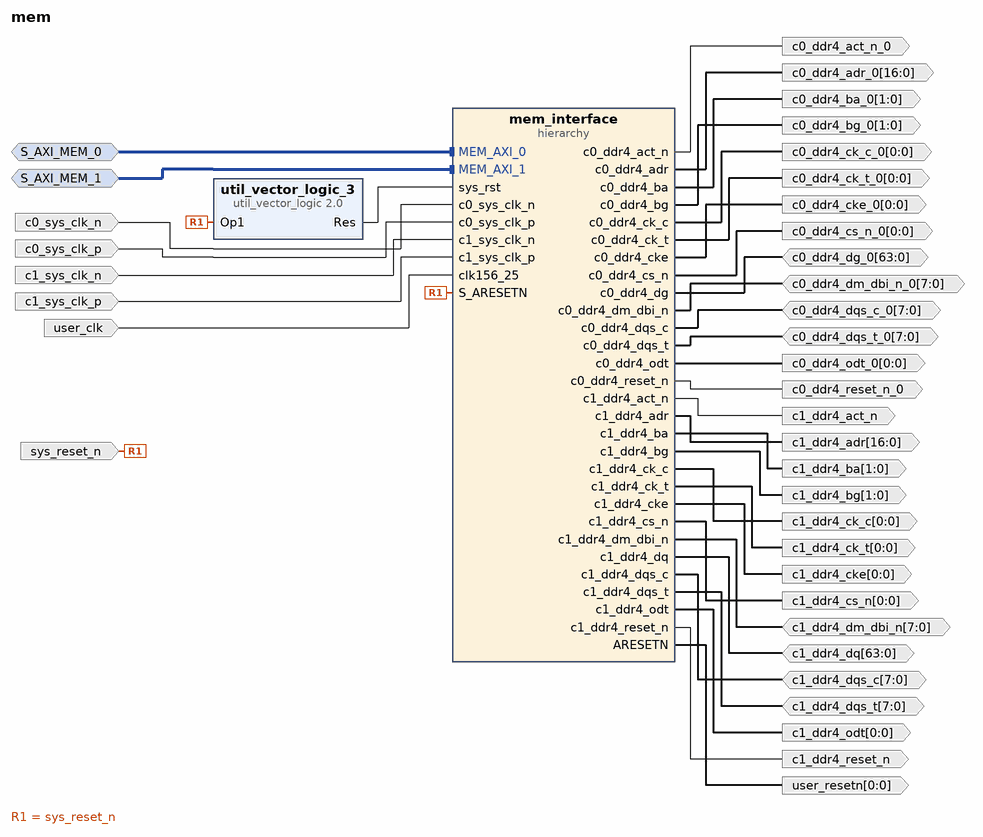
[diagram p0: block diagram of the top level]
# Vivado block design mem, xcku115-flva1517-2-e, Vivado 2018.2
create_bd_design mem

create_bd_intf_port -mode Slave -vlnv xilinx.com:interface:aximm_rtl:1.0 S_AXI_MEM_0
set_property -dict [list \
  CONFIG.DATA_WIDTH 512 \
  CONFIG.PROTOCOL AXI4 \
  CONFIG.ID_WIDTH 1 \
  CONFIG.ADDR_WIDTH 32 \
  CONFIG.AWUSER_WIDTH 0 \
  CONFIG.ARUSER_WIDTH 0 \
  CONFIG.WUSER_WIDTH 0 \
  CONFIG.RUSER_WIDTH 0 \
  CONFIG.BUSER_WIDTH 0 \
  CONFIG.READ_WRITE_MODE READ_WRITE \
  CONFIG.HAS_BURST 1 \
  CONFIG.HAS_LOCK 1 \
  CONFIG.HAS_PROT 1 \
  CONFIG.HAS_CACHE 1 \
  CONFIG.HAS_QOS 1 \
  CONFIG.HAS_REGION 1 \
  CONFIG.HAS_WSTRB 1 \
  CONFIG.HAS_BRESP 1 \
  CONFIG.HAS_RRESP 1 \
  CONFIG.SUPPORTS_NARROW_BURST 1 \
  CONFIG.NUM_READ_OUTSTANDING 2 \
  CONFIG.NUM_WRITE_OUTSTANDING 2 \
  CONFIG.MAX_BURST_LENGTH 256 \
  CONFIG.NUM_READ_THREADS 1 \
  CONFIG.NUM_WRITE_THREADS 1 \
  CONFIG.RUSER_BITS_PER_BYTE 0 \
  CONFIG.WUSER_BITS_PER_BYTE 0 \
] [get_bd_intf_ports S_AXI_MEM_0]
create_bd_intf_port -mode Slave -vlnv xilinx.com:interface:aximm_rtl:1.0 S_AXI_MEM_1
set_property -dict [list \
  CONFIG.DATA_WIDTH 512 \
  CONFIG.PROTOCOL AXI4 \
  CONFIG.ID_WIDTH 1 \
  CONFIG.ADDR_WIDTH 32 \
  CONFIG.AWUSER_WIDTH 0 \
  CONFIG.ARUSER_WIDTH 0 \
  CONFIG.WUSER_WIDTH 0 \
  CONFIG.RUSER_WIDTH 0 \
  CONFIG.BUSER_WIDTH 0 \
  CONFIG.READ_WRITE_MODE READ_WRITE \
  CONFIG.HAS_BURST 1 \
  CONFIG.HAS_LOCK 1 \
  CONFIG.HAS_PROT 1 \
  CONFIG.HAS_CACHE 1 \
  CONFIG.HAS_QOS 1 \
  CONFIG.HAS_REGION 1 \
  CONFIG.HAS_WSTRB 1 \
  CONFIG.HAS_BRESP 1 \
  CONFIG.HAS_RRESP 1 \
  CONFIG.SUPPORTS_NARROW_BURST 1 \
  CONFIG.NUM_READ_OUTSTANDING 2 \
  CONFIG.NUM_WRITE_OUTSTANDING 2 \
  CONFIG.MAX_BURST_LENGTH 256 \
  CONFIG.NUM_READ_THREADS 1 \
  CONFIG.NUM_WRITE_THREADS 1 \
  CONFIG.RUSER_BITS_PER_BYTE 0 \
  CONFIG.WUSER_BITS_PER_BYTE 0 \
] [get_bd_intf_ports S_AXI_MEM_1]
create_bd_port -dir O c0_ddr4_act_n_0
create_bd_port -dir O -from 16 -to 0 c0_ddr4_adr_0
create_bd_port -dir O -from 1 -to 0 c0_ddr4_ba_0
create_bd_port -dir O -from 1 -to 0 c0_ddr4_bg_0
create_bd_port -dir O -from 0 -to 0 -type clk c0_ddr4_ck_c_0
create_bd_port -dir O -from 0 -to 0 -type clk c0_ddr4_ck_t_0
create_bd_port -dir O -from 0 -to 0 c0_ddr4_cke_0
create_bd_port -dir O -from 0 -to 0 c0_ddr4_cs_n_0
create_bd_port -dir IO -from 63 -to 0 c0_ddr4_dg_0
create_bd_port -dir IO -from 7 -to 0 c0_ddr4_dm_dbi_n_0
create_bd_port -dir IO -from 7 -to 0 c0_ddr4_dqs_c_0
create_bd_port -dir IO -from 7 -to 0 c0_ddr4_dqs_t_0
create_bd_port -dir O -from 0 -to 0 c0_ddr4_odt_0
create_bd_port -dir O c0_ddr4_reset_n_0
create_bd_port -dir I -type clk c0_sys_clk_n
set_property -dict {CONFIG.FREQ_HZ 300000000} [get_bd_ports c0_sys_clk_n]
create_bd_port -dir I -type clk c0_sys_clk_p
set_property -dict {CONFIG.FREQ_HZ 300000000} [get_bd_ports c0_sys_clk_p]
create_bd_port -dir O c1_ddr4_act_n
create_bd_port -dir O -from 16 -to 0 c1_ddr4_adr
create_bd_port -dir O -from 1 -to 0 c1_ddr4_ba
create_bd_port -dir O -from 1 -to 0 c1_ddr4_bg
create_bd_port -dir O -from 0 -to 0 -type clk c1_ddr4_ck_c
create_bd_port -dir O -from 0 -to 0 -type clk c1_ddr4_ck_t
create_bd_port -dir O -from 0 -to 0 c1_ddr4_cke
create_bd_port -dir O -from 0 -to 0 c1_ddr4_cs_n
create_bd_port -dir IO -from 7 -to 0 c1_ddr4_dm_dbi_n
create_bd_port -dir IO -from 63 -to 0 c1_ddr4_dq
create_bd_port -dir IO -from 7 -to 0 c1_ddr4_dqs_c
create_bd_port -dir IO -from 7 -to 0 c1_ddr4_dqs_t
create_bd_port -dir O -from 0 -to 0 c1_ddr4_odt
create_bd_port -dir O c1_ddr4_reset_n
create_bd_port -dir I -type clk c1_sys_clk_n
set_property -dict {CONFIG.FREQ_HZ 300000000} [get_bd_ports c1_sys_clk_n]
create_bd_port -dir I -type clk c1_sys_clk_p
set_property -dict {CONFIG.FREQ_HZ 300000000} [get_bd_ports c1_sys_clk_p]
create_bd_port -dir I sys_reset_n
create_bd_port -dir I -type clk user_clk
create_bd_port -dir O -from 0 -to 0 user_resetn

create_bd_cell -type hier mem_interface
create_bd_cell -type ip -vlnv xilinx.com:ip:util_vector_logic:2.0 util_vector_logic_3
set_property -dict {CONFIG.C_SIZE 1 CONFIG.C_OPERATION not} [get_bd_cells util_vector_logic_3]

# ---- hierarchy /mem_interface ----
current_bd_instance /mem_interface
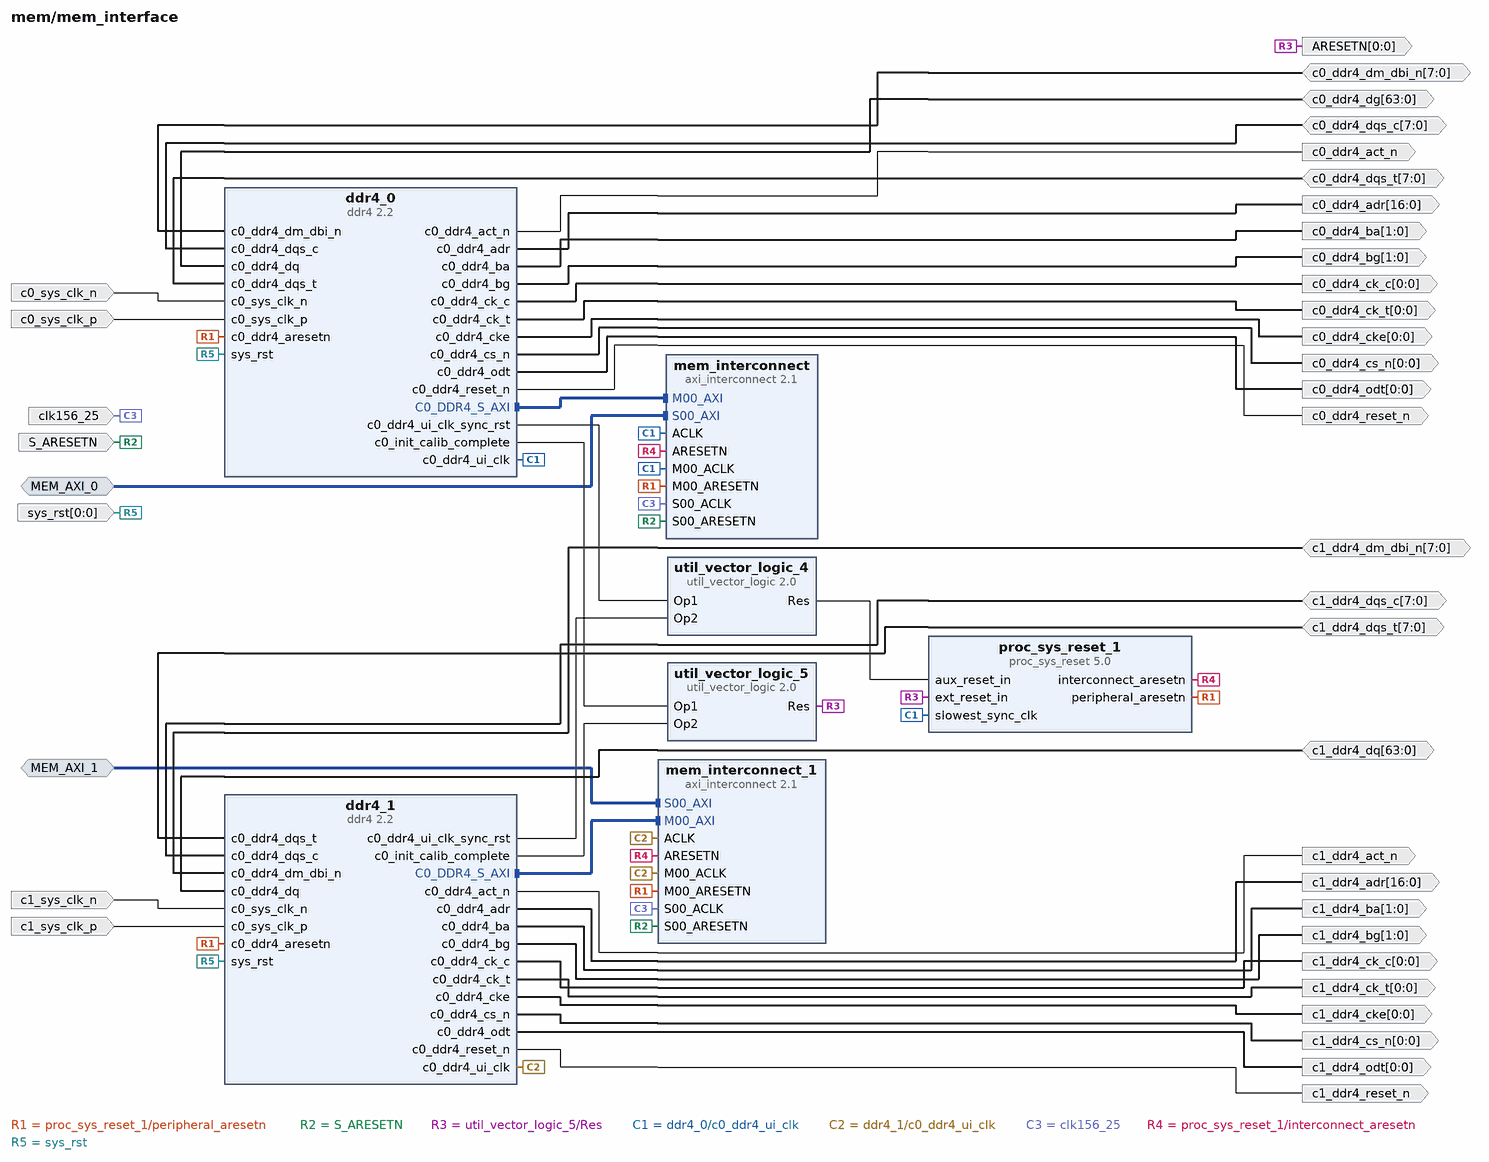
[diagram p1: block diagram inside /mem_interface]
create_bd_intf_pin -mode Slave -vlnv xilinx.com:interface:aximm_rtl:1.0 MEM_AXI_0
create_bd_intf_pin -mode Slave -vlnv xilinx.com:interface:aximm_rtl:1.0 MEM_AXI_1
create_bd_pin -dir O -from 0 -to 0 ARESETN
create_bd_pin -dir I -type rst S_ARESETN
create_bd_pin -dir O c0_ddr4_act_n
create_bd_pin -dir O -from 16 -to 0 c0_ddr4_adr
create_bd_pin -dir O -from 1 -to 0 c0_ddr4_ba
create_bd_pin -dir O -from 1 -to 0 c0_ddr4_bg
create_bd_pin -dir O -from 0 -to 0 -type clk c0_ddr4_ck_c
create_bd_pin -dir O -from 0 -to 0 -type clk c0_ddr4_ck_t
create_bd_pin -dir O -from 0 -to 0 c0_ddr4_cke
create_bd_pin -dir O -from 0 -to 0 c0_ddr4_cs_n
create_bd_pin -dir IO -from 63 -to 0 c0_ddr4_dg
create_bd_pin -dir IO -from 7 -to 0 c0_ddr4_dm_dbi_n
create_bd_pin -dir IO -from 7 -to 0 c0_ddr4_dqs_c
create_bd_pin -dir IO -from 7 -to 0 c0_ddr4_dqs_t
create_bd_pin -dir O -from 0 -to 0 c0_ddr4_odt
create_bd_pin -dir O c0_ddr4_reset_n
create_bd_pin -dir I -type clk c0_sys_clk_n
create_bd_pin -dir I -type clk c0_sys_clk_p
create_bd_pin -dir O c1_ddr4_act_n
create_bd_pin -dir O -from 16 -to 0 c1_ddr4_adr
create_bd_pin -dir O -from 1 -to 0 c1_ddr4_ba
create_bd_pin -dir O -from 1 -to 0 c1_ddr4_bg
create_bd_pin -dir O -from 0 -to 0 -type clk c1_ddr4_ck_c
create_bd_pin -dir O -from 0 -to 0 -type clk c1_ddr4_ck_t
create_bd_pin -dir O -from 0 -to 0 c1_ddr4_cke
create_bd_pin -dir O -from 0 -to 0 c1_ddr4_cs_n
create_bd_pin -dir IO -from 7 -to 0 c1_ddr4_dm_dbi_n
create_bd_pin -dir IO -from 63 -to 0 c1_ddr4_dq
create_bd_pin -dir IO -from 7 -to 0 c1_ddr4_dqs_c
create_bd_pin -dir IO -from 7 -to 0 c1_ddr4_dqs_t
create_bd_pin -dir O -from 0 -to 0 c1_ddr4_odt
create_bd_pin -dir O c1_ddr4_reset_n
create_bd_pin -dir I -type clk c1_sys_clk_n
create_bd_pin -dir I -type clk c1_sys_clk_p
create_bd_pin -dir I -type clk clk156_25
create_bd_pin -dir I -from 0 -to 0 -type rst sys_rst

create_bd_cell -type ip -vlnv xilinx.com:ip:ddr4:2.2 ddr4_0
set_property -dict [list \
  CONFIG.C0.DDR4_TimePeriod 939 \
  CONFIG.C0.DDR4_InputClockPeriod 3338 \
  CONFIG.C0.DDR4_MemoryPart MT40A512M8RH-075E \
  CONFIG.C0.DDR4_DataWidth 64 \
  CONFIG.C0.DDR4_CasLatency 15 \
  CONFIG.C0.DDR4_CasWriteLatency 11 \
  CONFIG.C0.DDR4_AxiDataWidth 512 \
  CONFIG.C0.DDR4_AxiAddressWidth 32 \
  CONFIG.C0.DDR4_isCustom false \
  CONFIG.Simulation_Mode Unisim \
  CONFIG.C0.ADDR_WIDTH 17 \
  CONFIG.C0.BANK_GROUP_WIDTH 2 \
] [get_bd_cells ddr4_0]
create_bd_cell -type ip -vlnv xilinx.com:ip:ddr4:2.2 ddr4_1
set_property -dict [list \
  CONFIG.C0.DDR4_TimePeriod 939 \
  CONFIG.C0.DDR4_InputClockPeriod 3338 \
  CONFIG.C0.DDR4_MemoryPart MT40A512M8RH-075E \
  CONFIG.C0.DDR4_DataWidth 64 \
  CONFIG.C0.DDR4_CasLatency 15 \
  CONFIG.C0.DDR4_CasWriteLatency 11 \
  CONFIG.C0.DDR4_AxiDataWidth 512 \
  CONFIG.C0.DDR4_AxiAddressWidth 32 \
  CONFIG.C0.DDR4_isCustom false \
  CONFIG.Simulation_Mode Unisim \
  CONFIG.C0.ADDR_WIDTH 17 \
  CONFIG.C0.BANK_GROUP_WIDTH 2 \
] [get_bd_cells ddr4_1]
create_bd_cell -type ip -vlnv xilinx.com:ip:axi_interconnect:2.1 mem_interconnect
set_property -dict [list \
  CONFIG.NUM_SI 1 \
  CONFIG.NUM_MI 1 \
  CONFIG.STRATEGY 0 \
  CONFIG.ENABLE_ADVANCED_OPTIONS 1 \
  CONFIG.XBAR_DATA_WIDTH 512 \
  CONFIG.SYNCHRONIZATION_STAGES 3 \
  CONFIG.M00_HAS_REGSLICE 3 \
  CONFIG.S00_HAS_REGSLICE 3 \
  CONFIG.S01_HAS_REGSLICE 3 \
  CONFIG.S02_HAS_REGSLICE 3 \
  CONFIG.S03_HAS_REGSLICE 3 \
  CONFIG.S00_HAS_DATA_FIFO 2 \
  CONFIG.S01_HAS_DATA_FIFO 2 \
  CONFIG.S02_HAS_DATA_FIFO 2 \
] [get_bd_cells mem_interconnect]
create_bd_cell -type ip -vlnv xilinx.com:ip:axi_interconnect:2.1 mem_interconnect_1
set_property -dict [list \
  CONFIG.NUM_SI 1 \
  CONFIG.NUM_MI 1 \
  CONFIG.STRATEGY 0 \
  CONFIG.ENABLE_ADVANCED_OPTIONS 1 \
  CONFIG.XBAR_DATA_WIDTH 512 \
  CONFIG.SYNCHRONIZATION_STAGES 3 \
  CONFIG.M00_HAS_REGSLICE 3 \
  CONFIG.S00_HAS_REGSLICE 3 \
  CONFIG.S01_HAS_REGSLICE 3 \
  CONFIG.S02_HAS_REGSLICE 3 \
  CONFIG.S03_HAS_REGSLICE 3 \
  CONFIG.S00_HAS_DATA_FIFO 2 \
  CONFIG.S01_HAS_DATA_FIFO 2 \
  CONFIG.S02_HAS_DATA_FIFO 2 \
] [get_bd_cells mem_interconnect_1]
create_bd_cell -type ip -vlnv xilinx.com:ip:proc_sys_reset:5.0 proc_sys_reset_1
set_property -dict {CONFIG.C_AUX_RESET_HIGH 1} [get_bd_cells proc_sys_reset_1]
create_bd_cell -type ip -vlnv xilinx.com:ip:util_vector_logic:2.0 util_vector_logic_4
set_property -dict {CONFIG.C_SIZE 1 CONFIG.C_OPERATION and} [get_bd_cells util_vector_logic_4]
create_bd_cell -type ip -vlnv xilinx.com:ip:util_vector_logic:2.0 util_vector_logic_5
set_property -dict {CONFIG.C_SIZE 1 CONFIG.C_OPERATION and} [get_bd_cells util_vector_logic_5]

# ---- connections ----

current_bd_instance /mem_interface
connect_bd_intf_net [get_bd_intf_pins ddr4_1/C0_DDR4_S_AXI] [get_bd_intf_pins mem_interconnect_1/M00_AXI]
connect_bd_intf_net -intf_net pcie_interconnect_M00_AXI [get_bd_intf_pins ddr4_0/C0_DDR4_S_AXI] [get_bd_intf_pins mem_interconnect/M00_AXI]
connect_bd_intf_net -intf_net MEM_AXI_0_1 [get_bd_intf_pins MEM_AXI_0] [get_bd_intf_pins mem_interconnect/S00_AXI]
connect_bd_intf_net -intf_net MEM_AXI_1_1 [get_bd_intf_pins MEM_AXI_1] [get_bd_intf_pins mem_interconnect_1/S00_AXI]
connect_bd_net -net M00_ARESETN_1 [get_bd_pins proc_sys_reset_1/peripheral_aresetn] \
  [get_bd_pins ddr4_0/c0_ddr4_aresetn] [get_bd_pins ddr4_1/c0_ddr4_aresetn] [get_bd_pins mem_interconnect/M00_ARESETN] \
  [get_bd_pins mem_interconnect_1/M00_ARESETN]
connect_bd_net [get_bd_pins c1_ddr4_dqs_t] [get_bd_pins ddr4_1/c0_ddr4_dqs_t]
connect_bd_net [get_bd_pins c1_ddr4_dqs_c] [get_bd_pins ddr4_1/c0_ddr4_dqs_c]
connect_bd_net [get_bd_pins c1_ddr4_dm_dbi_n] [get_bd_pins ddr4_1/c0_ddr4_dm_dbi_n]
connect_bd_net [get_bd_pins c1_ddr4_dq] [get_bd_pins ddr4_1/c0_ddr4_dq]
connect_bd_net [get_bd_pins c0_ddr4_dm_dbi_n] [get_bd_pins ddr4_0/c0_ddr4_dm_dbi_n]
connect_bd_net [get_bd_pins c0_ddr4_dqs_c] [get_bd_pins ddr4_0/c0_ddr4_dqs_c]
connect_bd_net [get_bd_pins c0_ddr4_dqs_t] [get_bd_pins ddr4_0/c0_ddr4_dqs_t]
connect_bd_net [get_bd_pins c0_ddr4_dg] [get_bd_pins ddr4_0/c0_ddr4_dq]
connect_bd_net -net S01_ARESETN_1 [get_bd_pins S_ARESETN] [get_bd_pins mem_interconnect/S00_ARESETN] [get_bd_pins mem_interconnect_1/S00_ARESETN]
connect_bd_net -net c1_sys_clk_n_1 [get_bd_pins c0_sys_clk_n] [get_bd_pins ddr4_0/c0_sys_clk_n]
connect_bd_net [get_bd_pins c1_sys_clk_n] [get_bd_pins ddr4_1/c0_sys_clk_n]
connect_bd_net -net c1_sys_clk_p_1 [get_bd_pins c0_sys_clk_p] [get_bd_pins ddr4_0/c0_sys_clk_p]
connect_bd_net [get_bd_pins c1_sys_clk_p] [get_bd_pins ddr4_1/c0_sys_clk_p]
connect_bd_net [get_bd_pins ddr4_0/c0_ddr4_ui_clk_sync_rst] [get_bd_pins util_vector_logic_4/Op1]
connect_bd_net -net ddr4_0_c0_init_calib_complete [get_bd_pins util_vector_logic_5/Res] \
  [get_bd_pins ARESETN] [get_bd_pins proc_sys_reset_1/ext_reset_in]
connect_bd_net [get_bd_pins ddr4_0/c0_init_calib_complete] [get_bd_pins util_vector_logic_5/Op1]
connect_bd_net -net ddr4_1_c0_ddr4_act_n [get_bd_pins ddr4_0/c0_ddr4_act_n] [get_bd_pins c0_ddr4_act_n]
connect_bd_net [get_bd_pins ddr4_1/c0_ddr4_act_n] [get_bd_pins c1_ddr4_act_n]
connect_bd_net -net ddr4_1_c0_ddr4_adr [get_bd_pins ddr4_0/c0_ddr4_adr] [get_bd_pins c0_ddr4_adr]
connect_bd_net [get_bd_pins ddr4_1/c0_ddr4_adr] [get_bd_pins c1_ddr4_adr]
connect_bd_net -net ddr4_1_c0_ddr4_ba [get_bd_pins ddr4_0/c0_ddr4_ba] [get_bd_pins c0_ddr4_ba]
connect_bd_net [get_bd_pins ddr4_1/c0_ddr4_ba] [get_bd_pins c1_ddr4_ba]
connect_bd_net -net ddr4_1_c0_ddr4_bg [get_bd_pins ddr4_0/c0_ddr4_bg] [get_bd_pins c0_ddr4_bg]
connect_bd_net [get_bd_pins ddr4_1/c0_ddr4_bg] [get_bd_pins c1_ddr4_bg]
connect_bd_net -net ddr4_1_c0_ddr4_ck_c [get_bd_pins ddr4_0/c0_ddr4_ck_c] [get_bd_pins c0_ddr4_ck_c]
connect_bd_net [get_bd_pins ddr4_1/c0_ddr4_ck_c] [get_bd_pins c1_ddr4_ck_c]
connect_bd_net -net ddr4_1_c0_ddr4_ck_t [get_bd_pins ddr4_0/c0_ddr4_ck_t] [get_bd_pins c0_ddr4_ck_t]
connect_bd_net [get_bd_pins ddr4_1/c0_ddr4_ck_t] [get_bd_pins c1_ddr4_ck_t]
connect_bd_net -net ddr4_1_c0_ddr4_cke [get_bd_pins ddr4_0/c0_ddr4_cke] [get_bd_pins c0_ddr4_cke]
connect_bd_net [get_bd_pins ddr4_1/c0_ddr4_cke] [get_bd_pins c1_ddr4_cke]
connect_bd_net -net ddr4_1_c0_ddr4_cs_n [get_bd_pins ddr4_0/c0_ddr4_cs_n] [get_bd_pins c0_ddr4_cs_n]
connect_bd_net [get_bd_pins ddr4_1/c0_ddr4_cs_n] [get_bd_pins c1_ddr4_cs_n]
connect_bd_net -net ddr4_1_c0_ddr4_odt [get_bd_pins ddr4_0/c0_ddr4_odt] [get_bd_pins c0_ddr4_odt]
connect_bd_net [get_bd_pins ddr4_1/c0_ddr4_odt] [get_bd_pins c1_ddr4_odt]
connect_bd_net -net ddr4_1_c0_ddr4_reset_n [get_bd_pins ddr4_0/c0_ddr4_reset_n] [get_bd_pins c0_ddr4_reset_n]
connect_bd_net [get_bd_pins ddr4_1/c0_ddr4_reset_n] [get_bd_pins c1_ddr4_reset_n]
connect_bd_net -net ddr4_1_c0_ddr4_ui_clk [get_bd_pins ddr4_0/c0_ddr4_ui_clk] \
  [get_bd_pins mem_interconnect/ACLK] [get_bd_pins mem_interconnect/M00_ACLK] [get_bd_pins proc_sys_reset_1/slowest_sync_clk]
connect_bd_net [get_bd_pins ddr4_1/c0_ddr4_ui_clk] [get_bd_pins mem_interconnect_1/ACLK] [get_bd_pins mem_interconnect_1/M00_ACLK]
connect_bd_net [get_bd_pins ddr4_1/c0_ddr4_ui_clk_sync_rst] [get_bd_pins util_vector_logic_4/Op2]
connect_bd_net [get_bd_pins ddr4_1/c0_init_calib_complete] [get_bd_pins util_vector_logic_5/Op2]
connect_bd_net -net m_axi_mm2s_aclk_1 [get_bd_pins clk156_25] [get_bd_pins mem_interconnect/S00_ACLK] [get_bd_pins mem_interconnect_1/S00_ACLK]
connect_bd_net [get_bd_pins proc_sys_reset_1/interconnect_aresetn] [get_bd_pins mem_interconnect/ARESETN] [get_bd_pins mem_interconnect_1/ARESETN]
connect_bd_net [get_bd_pins sys_rst] [get_bd_pins ddr4_0/sys_rst] [get_bd_pins ddr4_1/sys_rst]
connect_bd_net [get_bd_pins util_vector_logic_4/Res] [get_bd_pins proc_sys_reset_1/aux_reset_in]

current_bd_instance /
connect_bd_intf_net [get_bd_intf_ports S_AXI_MEM_0] [get_bd_intf_pins mem_interface/MEM_AXI_0]
connect_bd_intf_net -intf_net S_AXI_MEM_1_1 [get_bd_intf_ports S_AXI_MEM_1] [get_bd_intf_pins mem_interface/MEM_AXI_1]
connect_bd_net [get_bd_ports c0_ddr4_dg_0] [get_bd_pins mem_interface/c0_ddr4_dg]
connect_bd_net [get_bd_ports c0_ddr4_dm_dbi_n_0] [get_bd_pins mem_interface/c0_ddr4_dm_dbi_n]
connect_bd_net [get_bd_ports c0_ddr4_dqs_c_0] [get_bd_pins mem_interface/c0_ddr4_dqs_c]
connect_bd_net [get_bd_ports c0_ddr4_dqs_t_0] [get_bd_pins mem_interface/c0_ddr4_dqs_t]
connect_bd_net [get_bd_ports c1_ddr4_dqs_t] [get_bd_pins mem_interface/c1_ddr4_dqs_t]
connect_bd_net [get_bd_ports c1_ddr4_dqs_c] [get_bd_pins mem_interface/c1_ddr4_dqs_c]
connect_bd_net [get_bd_ports c1_ddr4_dm_dbi_n] [get_bd_pins mem_interface/c1_ddr4_dm_dbi_n]
connect_bd_net [get_bd_ports c1_ddr4_dq] [get_bd_pins mem_interface/c1_ddr4_dq]
connect_bd_net -net c0_sys_clk_n_0_1 [get_bd_ports c0_sys_clk_n] [get_bd_pins mem_interface/c0_sys_clk_n]
connect_bd_net -net c0_sys_clk_p_0_1 [get_bd_ports c0_sys_clk_p] [get_bd_pins mem_interface/c0_sys_clk_p]
connect_bd_net [get_bd_ports c1_sys_clk_n] [get_bd_pins mem_interface/c1_sys_clk_n]
connect_bd_net [get_bd_ports c1_sys_clk_p] [get_bd_pins mem_interface/c1_sys_clk_p]
connect_bd_net -net clk156_25_0_1 [get_bd_ports user_clk] [get_bd_pins mem_interface/clk156_25]
connect_bd_net [get_bd_pins mem_interface/ARESETN] [get_bd_ports user_resetn]
connect_bd_net [get_bd_pins mem_interface/c0_ddr4_act_n] [get_bd_ports c0_ddr4_act_n_0]
connect_bd_net [get_bd_pins mem_interface/c0_ddr4_adr] [get_bd_ports c0_ddr4_adr_0]
connect_bd_net [get_bd_pins mem_interface/c0_ddr4_ba] [get_bd_ports c0_ddr4_ba_0]
connect_bd_net [get_bd_pins mem_interface/c0_ddr4_bg] [get_bd_ports c0_ddr4_bg_0]
connect_bd_net [get_bd_pins mem_interface/c0_ddr4_ck_c] [get_bd_ports c0_ddr4_ck_c_0]
connect_bd_net [get_bd_pins mem_interface/c0_ddr4_ck_t] [get_bd_ports c0_ddr4_ck_t_0]
connect_bd_net [get_bd_pins mem_interface/c0_ddr4_cke] [get_bd_ports c0_ddr4_cke_0]
connect_bd_net [get_bd_pins mem_interface/c0_ddr4_cs_n] [get_bd_ports c0_ddr4_cs_n_0]
connect_bd_net [get_bd_pins mem_interface/c0_ddr4_odt] [get_bd_ports c0_ddr4_odt_0]
connect_bd_net [get_bd_pins mem_interface/c0_ddr4_reset_n] [get_bd_ports c0_ddr4_reset_n_0]
connect_bd_net [get_bd_pins mem_interface/c1_ddr4_act_n] [get_bd_ports c1_ddr4_act_n]
connect_bd_net [get_bd_pins mem_interface/c1_ddr4_adr] [get_bd_ports c1_ddr4_adr]
connect_bd_net [get_bd_pins mem_interface/c1_ddr4_ba] [get_bd_ports c1_ddr4_ba]
connect_bd_net [get_bd_pins mem_interface/c1_ddr4_bg] [get_bd_ports c1_ddr4_bg]
connect_bd_net [get_bd_pins mem_interface/c1_ddr4_ck_c] [get_bd_ports c1_ddr4_ck_c]
connect_bd_net [get_bd_pins mem_interface/c1_ddr4_ck_t] [get_bd_ports c1_ddr4_ck_t]
connect_bd_net [get_bd_pins mem_interface/c1_ddr4_cke] [get_bd_ports c1_ddr4_cke]
connect_bd_net [get_bd_pins mem_interface/c1_ddr4_cs_n] [get_bd_ports c1_ddr4_cs_n]
connect_bd_net [get_bd_pins mem_interface/c1_ddr4_odt] [get_bd_ports c1_ddr4_odt]
connect_bd_net [get_bd_pins mem_interface/c1_ddr4_reset_n] [get_bd_ports c1_ddr4_reset_n]
connect_bd_net [get_bd_ports sys_reset_n] [get_bd_pins mem_interface/S_ARESETN] [get_bd_pins util_vector_logic_3/Op1]
connect_bd_net -net sys_rst_1 [get_bd_pins util_vector_logic_3/Res] [get_bd_pins mem_interface/sys_rst]

# ---- address map ----
assign_bd_address -offset 0x00000000 -range 4G -target_address_space [get_bd_addr_spaces S_AXI_MEM_0] [get_bd_addr_segs mem_interface/ddr4_0/C0_DDR4_MEMORY_MAP/C0_DDR4_ADDRESS_BLOCK]
assign_bd_address -offset 0x00000000 -range 4G -target_address_space [get_bd_addr_spaces S_AXI_MEM_1] [get_bd_addr_segs mem_interface/ddr4_1/C0_DDR4_MEMORY_MAP/C0_DDR4_ADDRESS_BLOCK]

validate_bd_design
save_bd_design
